# Altium schematic sheet main.SchDoc: ESP32-C3_Dev_Board
size A4; Date: 13/08/2022; Author: HappyDonuts; Revision: 1.0; SheetNumber: 1; SheetTotal: 1
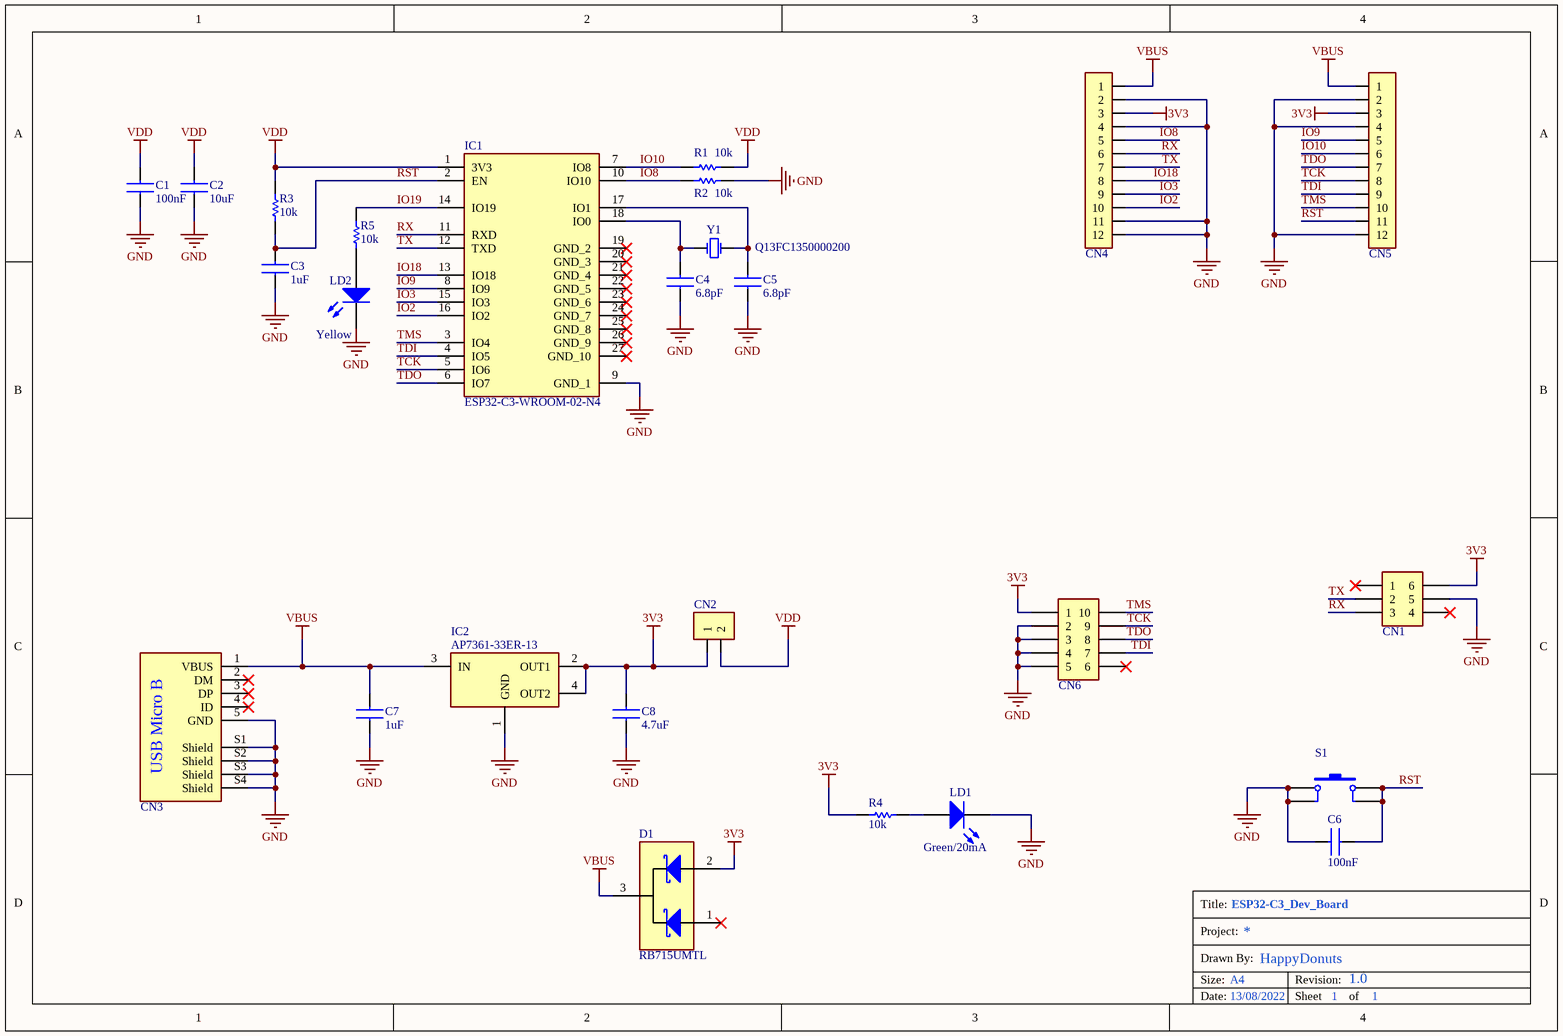
[diagram p0: main.SchDoc]

## Parts
C1  value 100nF  [CAPC2012X94N]  (hidden comment: CL21B104KBCNNNC)
C2  value 10uF  [CAPC2012X135N]  (hidden comment: CL21A106MQFNNNE)
C3  value 1uF  [CAPC2012X135N]  (hidden comment: CL21B105KBFNNNE)
C4  value 6.8pF  [CAPC2012X94N]  (hidden comment: CC0805CRNPO9BN6R8)
C5  value 6.8pF  [CAPC2012X94N]  (hidden comment: CC0805CRNPO9BN6R8)
C6  value 100nF  [CAPC2012X94N]  (hidden comment: CL21B104KBCNNNC)
C7  value 1uF  [CAPC2012X135N]  (hidden comment: CL21B105KBFNNNE)
C8  value 4.7uF  [CAPC2012X135N]  (hidden comment: CL21A475KBQNNNE)
CN1  CN_2X3_1.27_BOX_1  [CN_2X3_1.27_BOX_TH]  (value not drawn)
CN2  CN_2PIN  [CN_2PIN]  (value not drawn)
CN3  USB_B_AE  [USB_B_AE]  (value not drawn)
CN4  CN_12PIN  [CN_12PIN]  (value not drawn)
CN5  CN_12PIN  [CN_12PIN]  (value not drawn)
CN6  CN_2X5_1.27_BOX  [CN_2X5_1.27_BOX_TH]  (value not drawn)
D1  RB715UMTL  [DAN217UMTL]
IC1  ESP32-C3-WROOM-02-N4  [ESP32C3WROOM02N4]
IC2  AP7361-33ER-13  [SOT230P700X180-4N]
LD1  value Green/20mA  [LEDC2012X85N_G]  (hidden comment: LTST-C171KGKT)
LD2  value Yellow  [LEDC2012X85N_Y]  (hidden comment: LTST-C171KSKT)
R1  value 10k  [RESC2012X60N]  (hidden comment: RC0805FR-0710KL)
R2  value 10k  [RESC2012X60N]  (hidden comment: RC0805FR-0710KL)
R3  value 10k  [RESC2012X60N]  (hidden comment: RC0805FR-0710KL)
R4  value 10k  [RESC2012X60N]  (hidden comment: RC0805FR-0710KL)
R5  value 10k  [RESC2012X60N]  (hidden comment: RC0805FR-0710KL)
S1  SKRPABE010  [PTS815SJM250SMTRLFS]  (value not drawn)
Y1  Q13FC1350000200  [Q13FC1350000200]

## Nets
3V3: C8.2 CN1.6 CN2.1 CN4.3 CN5.3 CN6.1 D1.2(K_2) IC2.2(OUT1) IC2.4(OUT2) R4.1
GND: C1.1 C2.1 C3.1 C4.1 C5.1 C6.1 C7.1 C8.1 CN1.5 CN3.5(GND) CN3.S1(Shield) CN3.S2(Shield) CN3.S3(Shield) CN3.S4(Shield) CN4.2 CN4.4 CN4.11 CN4.12 CN5.2 CN5.4 CN5.12 CN6.2 CN6.3 CN6.4 CN6.5 IC1.9(GND_1) IC2.1(GND) LD1.1(K) LD2.1(K) R2.2 S1.1 S1.2
VBUS: C7.2 CN3.1(VBUS) CN4.1 CN5.1 D1.3(COM_A) IC2.3(IN)
VDD: C1.2 C2.2 CN2.2 IC1.1(3V3) R1.1 R3.2
IO2: CN4.10 IC1.16(IO2)
IO3: CN4.9 IC1.15(IO3)
IO8: CN4.5 IC1.10(IO10) R2.1
IO9: CN5.5 IC1.8(IO9)
IO10: CN5.6 IC1.7(IO8) R1.2
IO18: CN4.8 IC1.13(IO18)
IO19: IC1.14(IO19) R5.2
RST: C3.2 C6.2 CN5.11 IC1.2(EN) R3.1 S1.3 S1.4
RX: CN1.3 CN4.6 IC1.11(RXD)
TCK: CN5.8 CN6.9 IC1.5(IO6)
TDI: CN5.9 CN6.7 IC1.4(IO5)
TDO: CN5.7 CN6.8 IC1.6(IO7)
TMS: CN5.10 CN6.10 IC1.3(IO4)
TX: CN1.2 CN4.7 IC1.12(TXD)
NetC4_2: C4.2 IC1.18(IO0) Y1.1
NetC5_2: C5.2 IC1.17(IO1) Y1.2
NetLD1_2: LD1.2(A) R4.2
NetLD2_2: LD2.2(A) R5.1

Not connected (* = marked no-connect by the designer): CN1 1* 4*; CN3 2(DM)* 3(DP)* 4(ID)*; CN6 6*; D1 1(K_1)*; IC1 19(GND_2)* 20(GND_3)* 21(GND_4)* 22(GND_5)* 23(GND_6)* 24(GND_7)* 25(GND_8)* 26(GND_9)* 27(GND_10)*

## Notes on the sheet
- Title:
- Size:
- Date:
- Drawn By:
- Project:
- A4
- Revision:
- Sheet
- of
- (in symbol USB_B_AE) USB Micro B

## Library data of the parts
C1 C6 = CL21B104KBCNNNC: Capacitor; Manufacturer_Name: Samsung Electro-Mechanics; Datasheet Link: https://datasheet.datasheetarchive.com/originals/distributors/Datasheets_SAMA/86a3eaf0882763ef32124d5901f9b833.pdf; Height: 0.95mm; Manufacturer_Part_Number: CL21B104KBCNNNC; Mouser Part Number: 187-CL21B104KBCNNNC; Mouser Price/Stock: https://www.mouser.co.uk/ProductDetail/Samsung-Electro-Mechanics/CL21B104KBCNNNC?qs=349EhDEZ59pEfpnm5yBEmQ%3D%3D; Arrow Part Number: CL21B104KBCNNNC; Arrow Price/Stock: https://www.arrow.com/en/products/cl21b104kbcnnnc/samsung-electro-mechanics?region=europe
C2 = CL21A106MQFNNNE: Capacitor; Manufacturer_Name: Samsung Electro-Mechanics; Datasheet Link: https://componentsearchengine.com/Datasheets/2/CL21A106MQFNNNE.pdf; Height: 1.35mm; Manufacturer_Part_Number: CL21A106MQFNNNE; Mouser Part Number: 187-CL21A106MQFNNNE; Mouser Price/Stock: https://www.mouser.co.uk/ProductDetail/Samsung-Electro-Mechanics/CL21A106MQFNNNE?qs=yOVawPpwOwn3DWwGbD%252BRZA%3D%3D; Arrow Part Number: CL21A106MQFNNNE; Arrow Price/Stock: https://www.arrow.com/en/products/cl21a106mqfnnne/samsung-electro-mechanics
C3 C7 = CL21B105KBFNNNE: Capacitor; Manufacturer_Name: Samsung Electro-Mechanics; Datasheet Link: https://componentsearchengine.com/Datasheets/2/CL21B105KBFNNNE.pdf; Height: 1.35mm; Manufacturer_Part_Number: CL21B105KBFNNNE; Mouser Part Number: 187-CL21B105KBFNNNE; Mouser Price/Stock: https://www.mouser.co.uk/ProductDetail/Samsung-Electro-Mechanics/CL21B105KBFNNNE?qs=yOVawPpwOwmddQEBPU6Y9A%3D%3D; Arrow Part Number: CL21B105KBFNNNE; Arrow Price/Stock: https://www.arrow.com/en/products/cl21b105kbfnnne/samsung-electro-mechanics?region=europe
C4 C5 = CC0805CRNPO9BN6R8: Capacitor; Manufacturer_Name: YAGEO (PHYCOMP); Datasheet Link: https://componentsearchengine.com/Datasheets/1/CC0805CRNPO9BN6R8.pdf; Height: 0.7mm; Manufacturer_Part_Number: CC0805CRNPO9BN6R8; Mouser Part Number: 603-CC805CRNPO9BN6R8; Mouser Price/Stock: https://www.mouser.co.uk/ProductDetail/YAGEO/CC0805CRNPO9BN6R8?qs=5q%252BqlK8CmJQXpKtionjueA%3D%3D
C8 = CL21A475KBQNNNE: Capacitor; Manufacturer_Name: Samsung Electro-Mechanics; Datasheet Link: https://www.mouser.fr/datasheet/2/585/MLCC-1837944.pdf; Height: 1.35mm; Manufacturer_Part_Number: CL21A475KBQNNNE; Mouser Part Number: 187-CL21A475KBQNNNE
CN1 = CN_2X3_1.27_BOX_1: Connector
CN2 = CN_2PIN: Connector
CN3 = USB_B_AE: USB connector
CN4 CN5 = CN_12PIN: Connector
CN6 = CN_2X5_1.27_BOX: Connector
D1 = RB715UMTL: Schottky Diode; Manufacturer_Name: ROHM Semiconductor; Datasheet Link: http://uk.rs-online.com/web/p/products/1835297; Height: 1mm; Manufacturer_Part_Number: RB715UMTL; Mouser Part Number: 755-RB715UMTL; Mouser Price/Stock: https://www.mouser.co.uk/ProductDetail/ROHM-Semiconductor/RB715UMTL?qs=HXFqYaX1Q2wTXMfu8QxCQg%3D%3D
IC1 = ESP32-C3-WROOM-02-N4: Integrated Circuit; Manufacturer_Name: Espressif Systems; Datasheet Link: https://www.mouser.ch/datasheet/2/891/Espressif_ESP32_C3_WROOM_02-2006871.pdf; Height: 3.35mm; Manufacturer_Part_Number: ESP32-C3-WROOM-02-N4; Mouser Part Number: 356-ESP32C3WROOM02N4; Mouser Price/Stock: https://www.mouser.co.uk/ProductDetail/Espressif-Systems/ESP32-C3-WROOM-02-N4?qs=stqOd1AaK7%2FqjTZKEOgfUg%3D%3D
IC2 = AP7361-33ER-13: LDO; Manufacturer_Name: Diodes Inc.; Value: 3.3V; Datasheet Link: https://www.diodes.com/assets/Datasheets/AP7361.pdf; Height: 1.8mm; Manufacturer_Part_Number: AP7361-33ER-13; Mouser Part Number: 621-AP7361-33ER-13; Mouser Price/Stock: https://www.mouser.co.uk/ProductDetail/Diodes-Incorporated/AP7361-33ER-13?qs=gfe7vQ8txpWHFbeC09g4Zw%3D%3D; Arrow Part Number: AP7361-33ER-13; Arrow Price/Stock: https://www.arrow.com/en/products/ap7361-33er-13/diodes-incorporated?region=nac
LD1 = LTST-C171KGKT: LED; Manufacturer_Name: Lite-On; Datasheet Link: https://optoelectronics.liteon.com/upload/download/DS22-2000-118/LTST-C171KGKT.pdf; Height: 0.9mm; Manufacturer_Part_Number: LTST-C171KGKT; Mouser Part Number: 859-LTST-C171KGKT; Mouser Price/Stock: https://www.mouser.co.uk/ProductDetail/Lite-On/LTST-C171KGKT?qs=j1zysehuyChA38z%2F%252BFfUSw%3D%3D; Arrow Part Number: LTST-C171KGKT; Arrow Price/Stock: https://www.arrow.com/en/products/ltst-c171kgkt/lite-on-technology?region=nac
LD2 = LTST-C171KSKT: LED; Manufacturer_Name: Lite-On; Datasheet Link: https://componentsearchengine.com/Datasheets/1/LTST-C171KSKT.pdf; Height: 0.9mm; Manufacturer_Part_Number: LTST-C171KSKT; Mouser Part Number: 859-LTST-C171KSKT; Mouser Price/Stock: https://www.mouser.co.uk/ProductDetail/Lite-On/LTST-C171KSKT?qs=llMtm9xcdM0CwR1bByTaUQ%3D%3D; Arrow Part Number: LTST-C171KSKT; Arrow Price/Stock: https://www.arrow.com/en/products/ltst-c171kskt/lite-on-technology?region=nac
R1-R5 = RC0805FR-0710KL: Resistor; Manufacturer_Name: YAGEO (PHYCOMP); Datasheet Link: https://datasheet.datasheetarchive.com/originals/distributors/Datasheets_SAMA/902f9e387b938f871d31120f5fc1d65e.pdf; Height: 0.6mm; Manufacturer_Part_Number: RC0805FR-0710KL; Mouser Part Number: 603-RC0805FR-0710KL; Mouser Price/Stock: https://www.mouser.co.uk/ProductDetail/YAGEO/RC0805FR-0710KL?qs=7bY8808IzHq6vrU3BeiiYw%3D%3D; Arrow Part Number: RC0805FR-0710KL; Arrow Price/Stock: https://www.arrow.com/en/products/rc0805fr-0710kl/yageo?region=europe
S1 = SKRPABE010: Switch; Manufacturer_Name: ALPS Electric; Datasheet Link: https://datasheet.lcsc.com/szlcsc/ALPS-Electric-SKRPABE010_C115360.pdf; Height: 2.5mm; Manufacturer_Part_Number: SKRPABE010; Mouser Part Number: 688-SKRPAB; Mouser Price/Stock: https://www.mouser.co.uk/ProductDetail/Alps-Alpine/SKRPABE010?qs=m0BA540hBPe1GpcSf%2FZ5Yw%3D%3D
Y1 = Q13FC1350000200: Crystal; Manufacturer_Name: SEIKO EPSON; Value: 32.768kHz/7pF/70kOhms; Datasheet Link: https://datasheet.lcsc.com/szlcsc/Seiko-Epson-Q13FC1350000200_C48615.pdf; Height: 0.9mm; Manufacturer_Part_Number: Q13FC1350000200